# EAGLE design STorM32 Micro BGC v333i micro (EAGLE 7.5.0)
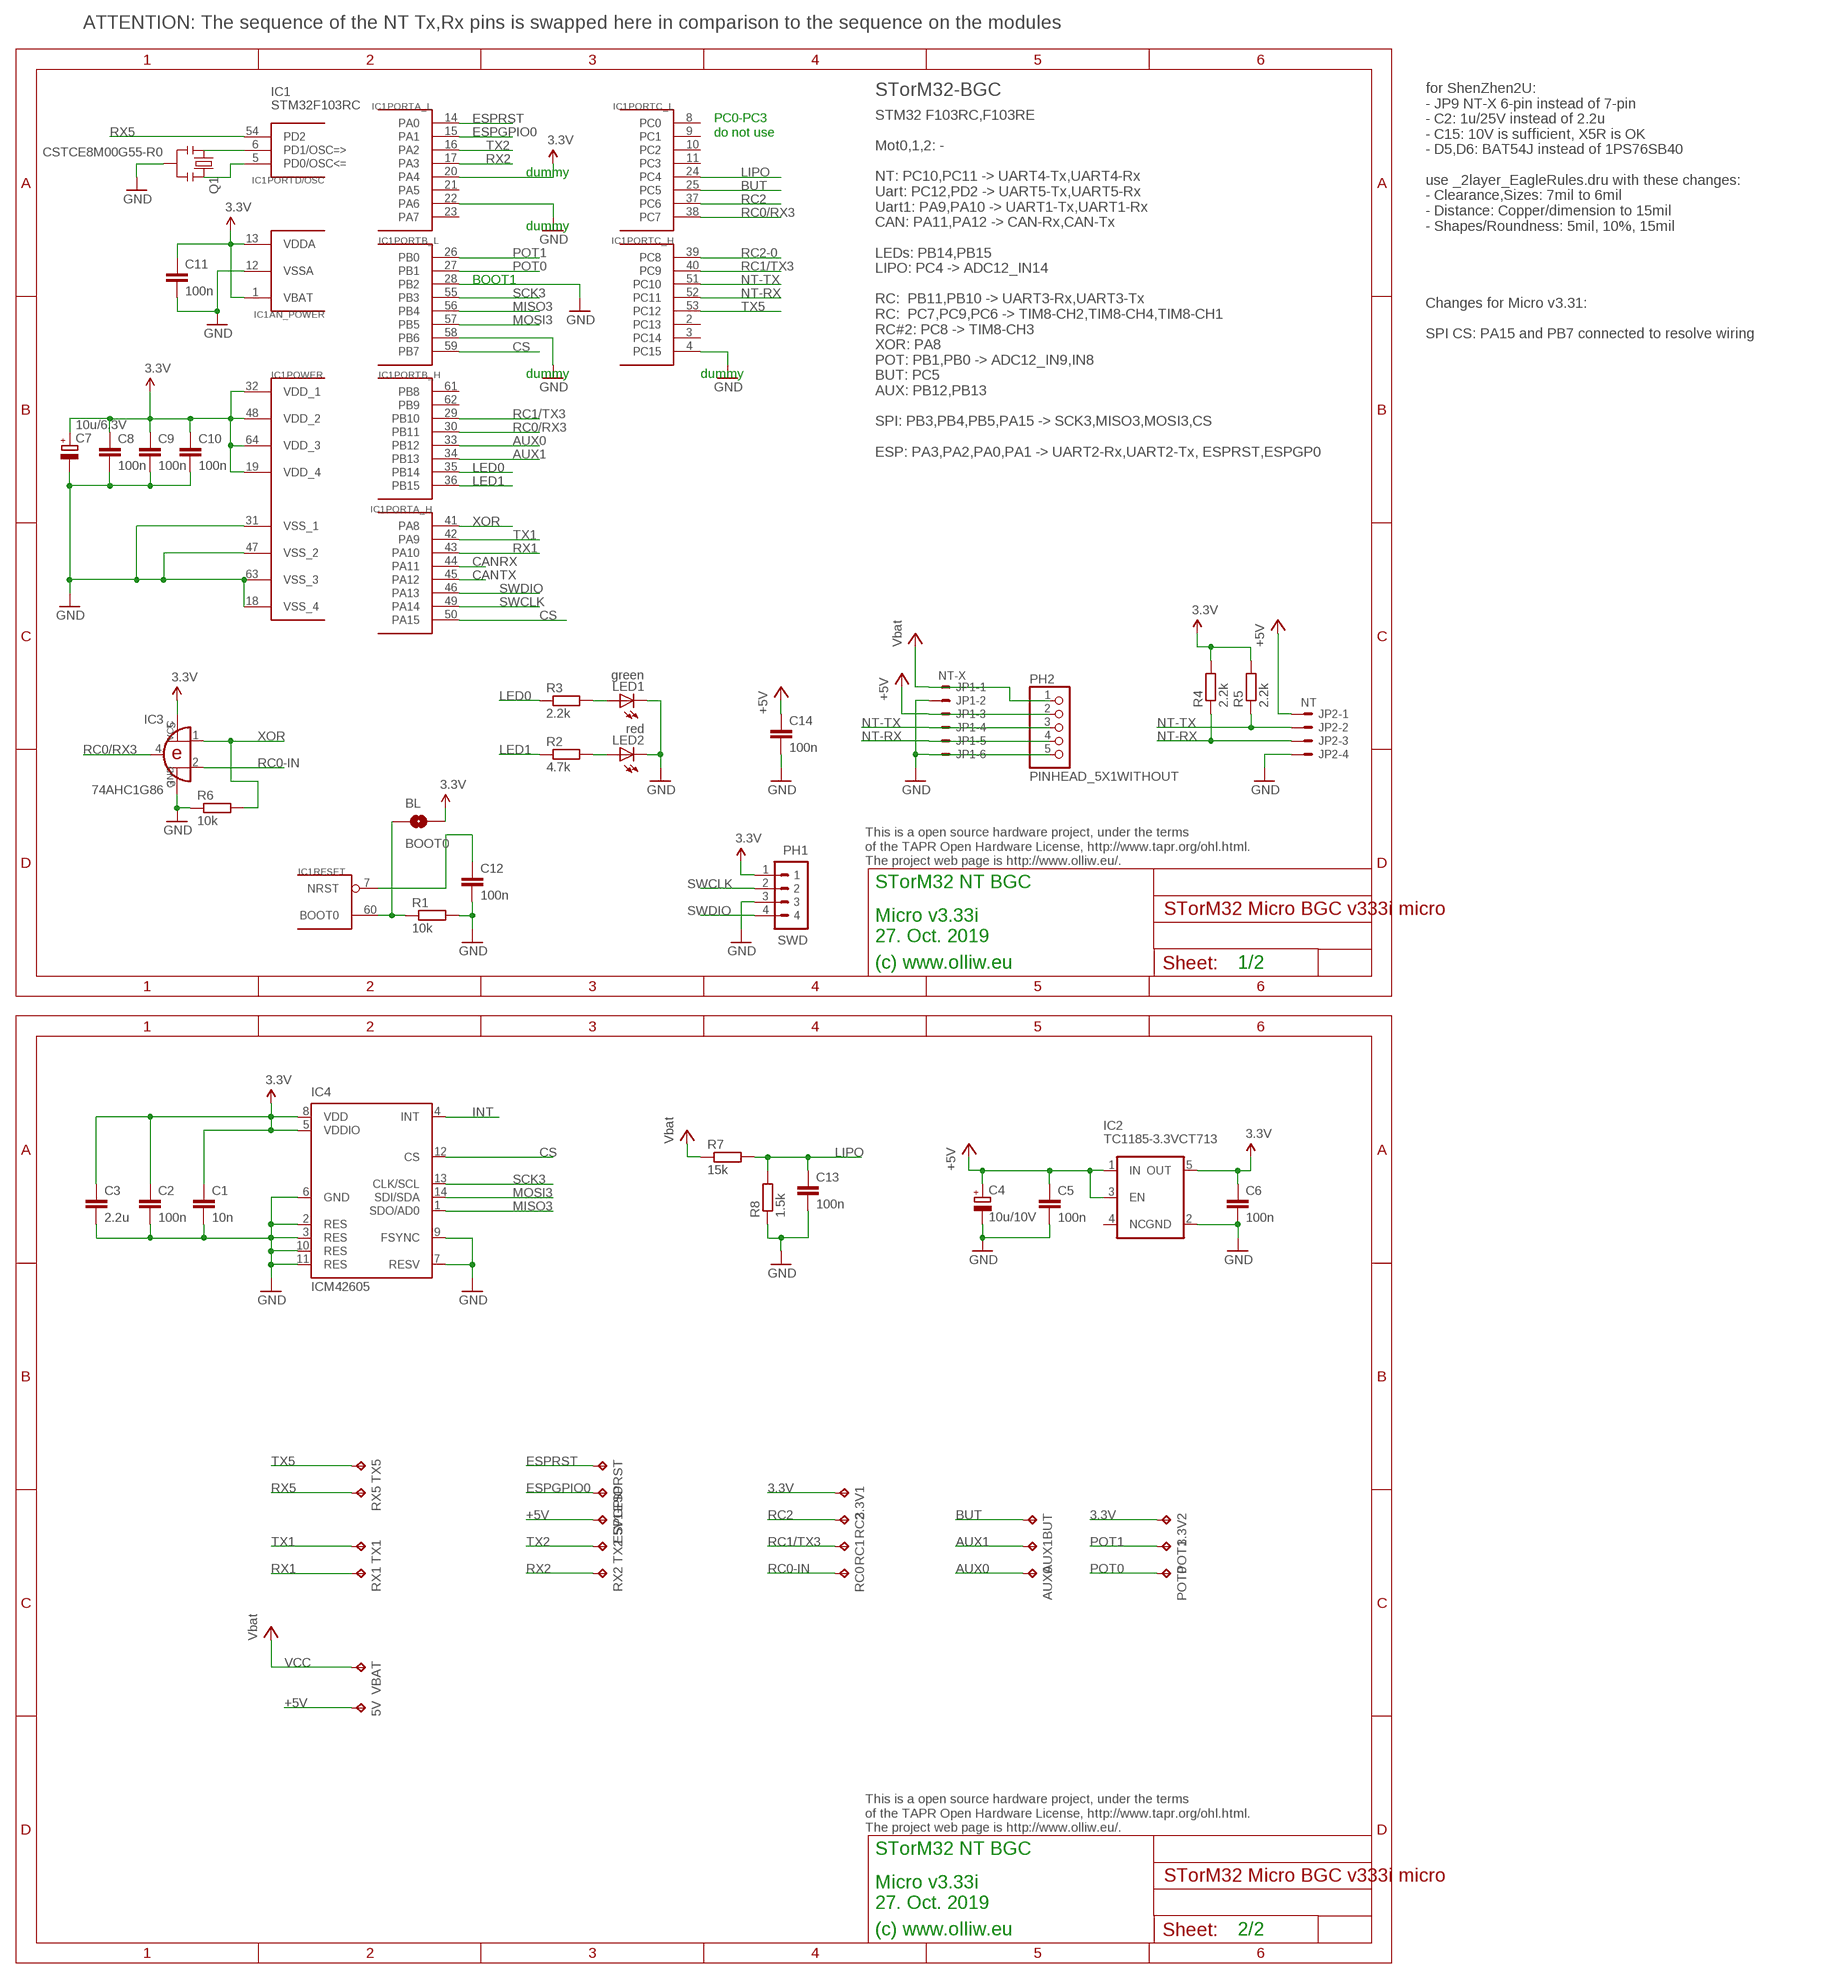
[diagram p0: schematic, sheet 1]

## Parts
3.3V1  TPB1,27  [B1,27]
3.3V2  TPB1,27  [B1,27]
5V  TPB1,27  [B1,27]
5V1  TPB1,27  [B1,27]
AUX0  TPB1,27  [B1,27]
AUX1  TPB1,27  [B1,27]
BL  BOOT0  SOLDERJUMPERNO  [SJ_2S-NO]
BUT  TPB1,27  [B1,27]
C1  10n  C-EUC0402  [C0402]
C2  100n  C-EUC0402  [C0402]
C3  2.2u  C-EUC0603  [C0603]
C4  10u/10V  CPOL-EUSMCA  [SMC_A]
C5  100n  C-EUC0603  [C0603]
C6  100n  C-EUC0402  [C0402]
C7  10u/6.3V  CPOL-EUSMCA  [SMC_A]
C8  100n  C-EUC0402  [C0402]
C9  100n  C-EUC0402  [C0402]
C10  100n  C-EUC0402  [C0402]
C11  100n  C-EUC0402  [C0402]
C12  100n  C-EUC0402  [C0402]
C13  100n  C-EUC0402  [C0402]
C14  100n  C-EUC0402  [C0402]
ESPGPIO  TPB1,27  [B1,27]
ESPRST  TPB1,27  [B1,27]
IC1  STM32F103RCT6  STM32F10XRXT6  [TQFP64]
IC2  TC1185-3.3VCT713  V_REG_TPS76433SOT23-5  [SOT23-5]
IC3  74AHC1G86  [SOT23-5-VER1]
IC4  ICM42605  [LGA14-2.5X3]
JP1  NT-X  SM06B-SRSS-TB  [SM06B-SRSS-TB]
JP2  NT  SM04B-SRSS-TB  [SM04B-SRSS-TB]
LED1  green  LEDCHIPLED_0603  [CHIPLED_0603]
LED2  red  LEDCHIPLED_0603  [CHIPLED_0603]
PH1  SWD  P4X1_1P27-OCT_BILEX  [4X1_1P27_OCT_BILEX]
PH2  PINHEAD_5X1WITHOUT  [PINHEAD_5X1_WO]
POT0  TPB1,27  [B1,27]
POT1  TPB1,27  [B1,27]
Q1  CSTCE8M00G55-R0  RESONATORSMD  [RESONATOR-SMD]
R1  10k  R-EU_R0402  [R0402]
R2  4.7k  R-EU_R0402  [R0402]
R3  2.2k  R-EU_R0402  [R0402]
R4  2.2k  R-EU_R0402  [R0402]
R5  2.2k  R-EU_R0402  [R0402]
R6  10k  R-EU_R0402  [R0402]
R7  15k  R-EU_R0402  [R0402]
R8  1.5k  R-EU_R0402  [R0402]
RC0  TPB1,27  [B1,27]
RC1  TPB1,27  [B1,27]
RC2  TPB1,27  [B1,27]
RX1  TPB1,27  [B1,27]
RX2  TPB1,27  [B1,27]
RX5  TPB1,27  [B1,27]
TX1  TPB1,27  [B1,27]
TX2  TPB1,27  [B1,27]
TX5  TPB1,27  [B1,27]
VBAT  TPB1,27  [B1,27]

## Nets
3.3V: 3.3V1.TP 3.3V2.TP BL.2 C1.1 C2.1 C3.1 C6.1 C7.+ C8.1 C9.1 C10.1 C11.1 IC1.1(AN_POWER:VBAT) IC1.13(AN_POWER:VDDA) IC1.19(POWER:VDD_4) IC1.20(PORTA_L:PA4) IC1.32(POWER:VDD_1) IC1.48(POWER:VDD_2) IC1.64(POWER:VDD_3) IC2.5(OUT) IC3.5(VCC) IC4.5(VDDIO) IC4.8(VDD) PH1.1 R4.2 R5.2
+5V: 5V1.TP 5V.TP C4.+ C5.1 C14.1 IC2.1(IN) IC2.3(EN) JP1.3 JP2.1 PH2.2
AUX0: AUX0.TP IC1.33(PORTB_H:PB12)
AUX1: AUX1.TP IC1.34(PORTB_H:PB13)
BOOT0: BL.1 IC1.60(RESET:BOOT0) R1.1
BUT: BUT.TP IC1.25(PORTC_L:PC5)
CANRX: IC1.44(PORTA_H:PA11)
CANTX: IC1.45(PORTA_H:PA12)
CS: IC1.50(PORTA_H:PA15) IC1.59(PORTB_L:PB7) IC4.12(CS)
ESPGPIO0: ESPGPIO.TP IC1.15(PORTA_L:PA1)
ESPRST: ESPRST.TP IC1.14(PORTA_L:PA0)
GND: C1.2 C2.2 C3.2 C4.- C5.2 C6.2 C7.- C8.2 C9.2 C10.2 C11.2 C12.2 C13.2 C14.2 IC1.4(PORTC_H:PC15) IC1.12(AN_POWER:VSSA) IC1.18(POWER:VSS_4) IC1.22(PORTA_L:PA6) IC1.28(PORTB_L:PB2) IC1.31(POWER:VSS_1) IC1.47(POWER:VSS_2) IC1.58(PORTB_L:PB6) IC1.63(POWER:VSS_3) IC2.2(GND) IC3.3(GND) IC4.2(RES) IC4.3(RES) IC4.6(GND) IC4.7(RESV) IC4.9(FSYNC) IC4.10(RES) IC4.11(RES) JP1.2 JP1.6 JP2.4 LED1.C LED2.C PH1.3 PH2.5 Q1.2 R1.2 R6.1 R8.1
INT: IC4.4(INT)
LED0: IC1.35(PORTB_H:PB14) R3.1
LED1: IC1.36(PORTB_H:PB15) R2.1
LIPO: C13.1 IC1.24(PORTC_L:PC4) R7.2 R8.2
MISO3: IC1.56(PORTB_L:PB4) IC4.1(SDO/AD0)
MOSI3: IC1.57(PORTB_L:PB5) IC4.14(SDI/SDA)
N$8: LED1.A R3.2
N$9: LED2.A R2.2
N$11: IC1.5(PORTD/OSC:PD0/OSC<=) Q1.3
N$12: IC1.6(PORTD/OSC:PD1/OSC=>) Q1.1
NRST: C12.1 IC1.7(RESET:NRST)
NT-RX: IC1.52(PORTC_H:PC11) JP1.5 JP2.3 PH2.4 R4.1
NT-TX: IC1.51(PORTC_H:PC10) JP1.4 JP2.2 PH2.3 R5.1
POT0: IC1.27(PORTB_L:PB1) POT0.TP
POT1: IC1.26(PORTB_L:PB0) POT1.TP
RC0-IN: IC3.2(I1) RC0.TP
RC0/RX3: IC1.30(PORTB_H:PB11) IC1.38(PORTC_L:PC7) IC3.4(O)
RC1/TX3: IC1.29(PORTB_H:PB10) IC1.40(PORTC_H:PC9) RC1.TP
RC2: IC1.37(PORTC_L:PC6) RC2.TP
RC2-0: IC1.39(PORTC_H:PC8)
RX1: IC1.43(PORTA_H:PA10) RX1.TP
RX2: IC1.17(PORTA_L:PA3) RX2.TP
RX5: IC1.54(PORTD/OSC:PD2) RX5.TP
SCK3: IC1.55(PORTB_L:PB3) IC4.13(CLK/SCL)
SWCLK: IC1.49(PORTA_H:PA14) PH1.2
SWDIO: IC1.46(PORTA_H:PA13) PH1.4
TX1: IC1.42(PORTA_H:PA9) TX1.TP
TX2: IC1.16(PORTA_L:PA2) TX2.TP
TX5: IC1.53(PORTC_H:PC12) TX5.TP
VCC: JP1.1 PH2.1 R7.1 VBAT.TP ; supply symbol labelled Vbat
XOR: IC1.41(PORTA_H:PA8) IC3.1(I0) R6.2
Unconnected: IC1.2(PORTC_H:PC13) IC1.3(PORTC_H:PC14) IC1.8(PORTC_L:PC0) IC1.9(PORTC_L:PC1) IC1.10(PORTC_L:PC2) IC1.11(PORTC_L:PC3) IC1.21(PORTA_L:PA5) IC1.23(PORTA_L:PA7) IC1.61(PORTB_H:PB8) IC1.62(PORTB_H:PB9) IC2.4(NC)

## Notes on the sheet
- ATTENTION: The sequence of the NT Tx,Rx pins is swapped here in comparison to the sequence on the modules
- for ShenZhen2U:
  - JP9 NT-X 6-pin instead of 7-pin
  - C2: 1u/25V instead of 2.2u
  - C15: 10V is sufficient, X5R is OK
  - D5,D6: BAT54J instead of 1PS76SB40
  
  use _2layer_EagleRules.dru with these changes:
  - Clearance,Sizes: 7mil to 6mil
  - Distance: Copper/dimension to 15mil
  - Shapes/Roundness: 5mil, 10%, 15mil
- IC1 | STorM32-BGC
- STM32F103RC
- STM32 F103RC,F103RE
  
  Mot0,1,2: -
  
  NT: PC10,PC11 -> UART4-Tx,UART4-Rx
  Uart: PC12,PD2 -> UART5-Tx,UART5-Rx
  Uart1: PA9,PA10 -> UART1-Tx,UART1-Rx
  CAN: PA11,PA12 -> CAN-Rx,CAN-Tx
  
  LEDs: PB14,PB15
  LIPO: PC4 -> ADC12_IN14
  
  RC:  PB11,PB10 -> UART3-Rx,UART3-Tx
  RC:  PC7,PC9,PC6 -> TIM8-CH2,TIM8-CH4,TIM8-CH1
  RC#2: PC8 -> TIM8-CH3
  XOR: PA8
  POT: PB1,PB0 -> ADC12_IN9,IN8
  BUT: PC5
  AUX: PB12,PB13
  
  SPI: PB3,PB4,PB5,PA15 -> SCK3,MISO3,MOSI3,CS
  
  ESP: PA3,PA2,PA0,PA1 -> UART2-Rx,UART2-Tx, ESPRST,ESPGP0
- PC0-PC3
  do not use
- dummy
- dummy
- BOOT1
- Changes for Micro v3.31:
  
  SPI CS: PA15 and PB7 connected to resolve wiring
- dummy | dummy
- This is a open source hardware project, under the terms
  of the TAPR Open Hardware License, http://www.tapr.org/ohl.html.
  The project web page is http://www.olliw.eu/.
- STorM32 NT BGC
- Micro v3.33i
  27. Oct. 2019
- (c) www.olliw.eu | 1/2
- This is a open source hardware project, under the terms
  of the TAPR Open Hardware License, http://www.tapr.org/ohl.html.
  The project web page is http://www.olliw.eu/.
- STorM32 NT BGC
- Micro v3.33i
  27. Oct. 2019
- (c) www.olliw.eu | 2/2

## Library data of the parts
3.3V1 3.3V2 5V 5V1 AUX0 AUX1 BUT ESPGPIO ESPRST POT0 POT1 RC0 RC1 RC2 RX1 RX2 RX5 TX1 TX2 TX5 VBAT = testpad:TP: Test pad
BL = # SparkFun2:SOLDERJUMPER: Solder Jumper Standard SMD solder jumper. Used to automate production. Two varients : Normally Open and Normally Closed are the same, but have different paste layers. NC will have a large amount of paste and should jumper during reflow.
C1-C3 C5 C6 C8-C14 = rcl:C-EU: CAPACITOR, European symbol
C4 C7 = rcl:CPOL-EU: POLARIZED CAPACITOR, European symbol
IC1 = # stm32:STM32F10XRXT6: STM32F101/103 64pin LQFP
IC2 = # SparkFun2:V_REG_TPS76433: Voltage Regulator Older TI part. LDO 150mA regulator. No output by-pass cap option. See V_REG_LDO for a better part.
IC3 = # stdlib:74AHC1G86
IC4 = # stdlib:ICM42605
JP1 = con-jst2:?M06B-SRSS-TB: Disconnectable Crimp style connector, 1.0mm pitch 6 contacts
JP2 = con-jst2:?M04B-SRSS-TB: Disconnectable Crimp style connector, 1.0mm pitch 4 contacts
LED1 LED2 = led:LED: LED OSRAM: - CHIPLED LG R971, LG N971, LY N971, LG Q971, LY Q971, LO R971, LY R971 LH N974, LH R974 LS Q976, LO Q976, LY Q976 LO Q996 - Hyper CHIPLED LW Q18S LB Q993, LB Q99A, LB R99A - SideLED LS A670, LO A670, LY A670, LG A670, LP A670 LB A673, LV A673, LT A673, LW A673 LH A674 LY A675 LS A676, LA A676, LO A676, LY A676, LW A676 LS A679, LY A679, LG A679 - Hyper Micro SIDELED® LS Y876, LA Y876, LO Y876, LY Y876 LT Y87S - SmartLED LW L88C, LW L88S LB L89C, LB L89S, LG L890 LS L89K, LO L89K, LY L89K LS L896, LA L896, LO L896, LY L896 - TOPLED LS T670, LO T670, LY T670, LG T670, LP T670 LSG T670, LSP T670, LSY T670, LOP T670, LYG T670 LG T671, LOG T671, LSG T671 LB T673, LV T673, LT T673, LW T673 LH T674 LS T676, LA T676, LO T676, LY T676, LB T676, LH T676, LSB T676, LW T676 LB T67C, LV T67C, LT T67C, LS T67K, LO T67K, LY T67K, LW E67C LS E67B, LA E67B, LO E67B, LY E67B, LB E67C, LV E67C, LT E67C LW T67C LS T679, LY T679, LG T679 LS T770, LO T770, LY T770, LG T770, LP T770 LB T773, LV T773, LT T773, LW T773 LH T774 LS E675, LA E675, LY E675, LS T675 LS T776, LA T776, LO T776, LY T776, LB T776 LHGB T686 LT T68C, LB T68C - Hyper Mini TOPLED® LB M676 - Mini TOPLED Santana® LG M470 LS M47K, LO M47K, LY M47K Source: http://www.osram.convergy.de LUXEON: - LUMILED® LXK2-PW12-R00, LXK2-PW12-S00, LXK2-PW14-U00, LXK2-PW14-V00 LXK2-PM12-R00, LXK2-PM12-S00, LXK2-PM14-U00 LXK2-PE12-Q00, LXK2-PE12-R00, LXK2-PE12-S00, LXK2-PE14-T00, LXK2-PE14-U00 LXK2-PB12-K00, LXK2-PB12-L00, LXK2-PB12-M00, LXK2-PB14-N00, LXK2-PB14-P00, LXK2-PB14-Q00 LXK2-PR12-L00, LXK2-PR12-M00, LXK2-PR14-Q00, LXK2-PR14-R00 LXK2-PD12-Q00, LXK2-PD12-R00, LXK2-PD12-S00 LXK2-PH12-R00, LXK2-PH12-S00 LXK2-PL12-P00, LXK2-PL12-Q00, LXK2-PL12-R00 Source: www.luxeon.com KINGBRIGHT: KA-3528ASYC Source: www.kingbright.com
PH1 = # stdlib:P4X1_1P27
PH2 = # stdlib:PINHEAD_5X1
Q1 = # SparkFun2:RESONATOR: Resonator Small SMD resonator. This is the itty bitty 10/20MHz resonators with built in caps. CSTCE10M0G55 and CSTCE20M0V53. Footprint has been reviewed closely but hasn't been tested yet.
R1-R8 = rcl:R-EU_: RESISTOR, European symbol

## Board
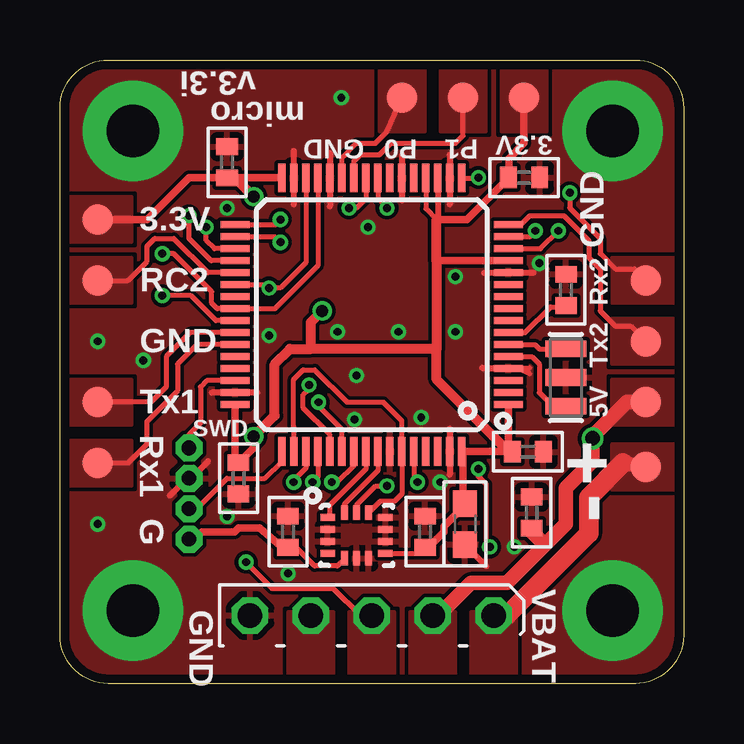
[diagram p1: board, top side]
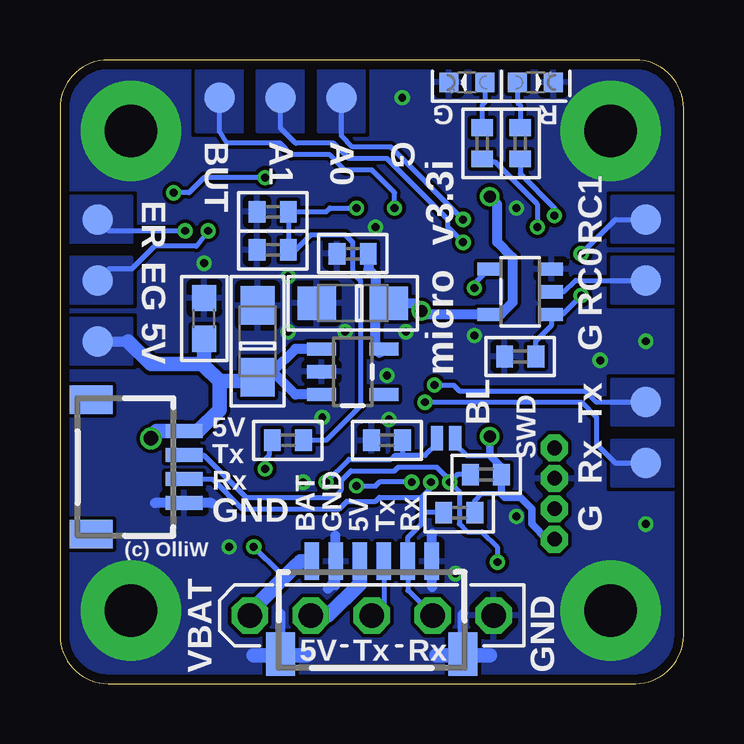
[diagram p2: board, bottom side, seen from below]

Size 26 x 26 mm. Coordinates in mm from the lower left corner, seen from the top.
Outline: 24,0 2,0 arc-90 0,2 0,24 arc-90 2,26 24,26 arc-90 26,24 26,2 arc-90 24,0
Copper layers (1*16): Top 0.035mm / dielectric 1.5mm / Bottom 0.035mm
Design rules "ShenZhen2U_2layer_EagleRules *": minimum track width 6mil, minimum drill 12mil, track to track 6mil, track to pad 6mil, pad to pad 6mil, via to via 6mil, smd to smd 0mil, copper to edge 15mil, drill to drill 10mil, minimum pad ring 10mil, minimum via ring 6mil, stop-mask expansion 2mil, vias tented up to drill 25mil, thermal gap 10mil

### Footprints (pad centres in the part's own frame; a part is rotated, then mirrored left to right if it is on the bottom)
B1,27 = smd 1.27 x 1.27: TP 0,0
SJ_2S-NO = smd 0.508 x 1.016: 1 -0.381,0; 2 0.381,0
C0402 = smd 0.7 x 0.9: 1 -0.65,0; 2 0.65,0
C0603 = smd 1.1 x 1: 1 -0.85,0; 2 0.85,0
SMC_A = smd 1.6 x 1.4: + -1.5,0; - 1.5,0
TQFP64 = smd 1.2 x 0.3: 1 -5.7,3.75; 2 -5.7,3.25; 3 -5.7,2.75; 4 -5.7,2.25; 5 -5.7,1.75; 6 -5.7,1.25; 7 -5.7,0.75; 8 -5.7,0.25; 9 -5.7,-0.25; 10 -5.7,-0.75; 11 -5.7,-1.25; 12 -5.7,-1.75; 13 -5.7,-2.25; 14 -5.7,-2.75; 15 -5.7,-3.25; 16 -5.7,-3.75; 33 5.7,-3.75; 34 5.7,-3.25; 35 5.7,-2.75; 36 5.7,-2.25; 37 5.7,-1.75; 38 5.7,-1.25; 39 5.7,-0.75; 40 5.7,-0.25; 41 5.7,0.25; 42 5.7,0.75; 43 5.7,1.25; 44 5.7,1.75; 45 5.7,2.25; 46 5.7,2.75; 47 5.7,3.25; 48 5.7,3.75 | smd 0.3 x 1.2: 17 -3.75,-5.7; 18 -3.25,-5.7; 19 -2.75,-5.7; 20 -2.25,-5.7; 21 -1.75,-5.7; 22 -1.25,-5.7; 23 -0.75,-5.7; 24 -0.25,-5.7; 25 0.25,-5.7; 26 0.75,-5.7; 27 1.25,-5.7; 28 1.75,-5.7; 29 2.25,-5.7; 30 2.75,-5.7; 31 3.25,-5.7; 32 3.75,-5.7; 49 3.75,5.7; 50 3.25,5.7; 51 2.75,5.7; 52 2.25,5.7; 53 1.75,5.7; 54 1.25,5.7; 55 0.75,5.7; 56 0.25,5.7; 57 -0.25,5.7; 58 -0.75,5.7; 59 -1.25,5.7; 60 -1.75,5.7; 61 -2.25,5.7; 62 -2.75,5.7; 63 -3.25,5.7; 64 -3.75,5.7
SOT23-5 = smd 0.55 x 1.2: 1 -0.95,-1.3; 2 0,-1.3; 3 0.95,-1.3; 4 0.95,1.3; 5 -0.95,1.3
SOT23-5-VER1 = smd 0.55 x 0.99: 1 -0.95,-1.29; 2 0,-1.29; 3 0.95,-1.29; 4 0.95,1.3; 5 -0.95,1.3
LGA14-2.5X3 = smd 0.6 x 0.3: 1 -1.2,0.75; 2 -1.2,0.25; 3 -1.2,-0.25; 4 -1.2,-0.75; 8 1.2,-0.75; 9 1.2,-0.25; 10 1.2,0.25; 11 1.2,0.75 | smd 0.3 x 0.6: 5 -0.5,-0.95; 6 0,-0.95; 7 0.5,-0.95; 12 0.5,0.95; 13 0,0.95; 14 -0.5,0.95
SM06B-SRSS-TB = smd 0.6 x 1.55: 1 -2.5,2.975; 2 -1.5,2.975; 3 -0.5,2.975; 4 0.5,2.975; 5 1.5,2.975; 6 2.5,2.975 | smd 1.2 x 1.8: FIT@1 -3.8,-0.9; FIT@2 3.8,-0.9
SM04B-SRSS-TB = smd 0.6 x 1.55: 1 -1.5,2.975; 2 -0.5,2.975; 3 0.5,2.975; 4 1.5,2.975 | smd 1.2 x 1.8: FIT@1 -2.8,-0.9; FIT@2 2.8,-0.9
CHIPLED_0603 = smd 0.8 x 0.8: A 0,-0.75; C 0,0.75
4X1_1P27_OCT_BILEX = drill 0.61 pad 1.118 octagon: 1 0,0; 2 0,-1.27; 3 0,-2.54; 4 0,-3.81
PINHEAD_5X1_WO = drill 1.016 octagon: 1 0,0; 2 0,-2.54; 3 0,-5.08; 4 0,-7.62; 5 0,-10.16
RESONATOR-SMD = smd 0.7 x 1.7: 1 -1.2,0; 2 0,0; 3 1.2,0
R0402 = smd 0.7 x 0.9: 1 -0.65,0; 2 0.65,0

### Placement (x,y rotation side)
3.3V1  1.57,19.35 0 top
3.3V2  19.35,24.43 0 top
5V  24.43,11.73 0 top
5V1  24.43,14.27 0 bottom
AUX0  14.27,24.43 0 bottom
AUX1  16.81,24.43 0 bottom
BL  9.9,10.22 0 bottom
BUT  19.35,24.43 0 bottom
C1  15.22,6.33 90 top
C2  9.51,6.33 90 top
C3  16.89,6.65 270 top
C4  17.76,14.27 90 bottom
C5  19.98,15.22 90 bottom
C6  13.79,17.92 180 bottom
C7  13.79,15.86 180 bottom
C8  19.51,9.67 0 top
C9  6.97,21.73 90 top
C10  7.44,8.55 270 top
C11  19.35,21.1 0 top
C12  21.1,16.41 90 top
C13  17.13,19.67 180 bottom
C14  19.67,7.13 90 top
ESPGPIO  24.43,16.81 0 bottom
ESPRST  24.43,19.35 0 bottom
IC1  13,15.38 180 top
IC2  13.79,13 270 bottom
IC3  6.81,16.33 90 bottom
IC4  12.37,6.17 0 top
JP1  13,2.13 0 bottom
JP2  23.8,9.03 270 bottom
LED1  9.03,25.06 90 bottom
LED2  6.17,25.06 270 bottom
PH1  5.38,6.02 180 top
PH2  18.08,2.84 270 top
POT0  14.27,24.43 0 top
POT1  16.81,24.43 0 top
Q1  21.1,12.76 270 top
R1  12.37,10.14 180 bottom
R2  6.81,22.52 90 bottom
R3  8.4,22.52 90 bottom
R4  9.35,7.13 0 bottom
R5  8.24,8.71 0 bottom
R6  6.81,13.63 0 bottom
R7  16.49,10.14 0 bottom
R8  17.13,18.08 0 bottom
RC0  1.57,16.81 0 bottom
RC1  1.57,19.35 0 bottom
RC2  1.57,16.81 0 top
RX1  1.57,9.19 0 top
RX2  24.43,16.81 0 top
RX5  1.57,9.19 0 bottom
TX1  1.57,11.73 0 top
TX2  24.43,14.27 0 top
TX5  1.57,11.73 0 bottom
VBAT  24.43,9.03 0 top

### Tracks (layer width: path | path; a pad name or v marks a point on that pad's centre or on a via)
3.3V  (via drill 0.5)
  Top 0.203: 18.72,21.11 C11.1 | IC1.20 15.25,19.8 15.7,19.35 15.75,19.4 | IC4.5 11.71,5.04 11.57,4.9 10.62,4.9 9.83,5.7 9.57,5.52 C2.1 | C2.1 9.51,5.54 | 15.45,5.76 C1.1 15.12,5.42 IC4.8 | C2.1 9.36,5.6
  Top 0.254: IC1.19 15.75,19.4
  Top 0.305: C11.1 18.72,21.1 | 18.72,21.1 16.97,19.35 15.7,19.35 | C8.1 18.69,9.68 IC1.64 16.81,9.62 16.81,7.92 16.89,7.84 C3.1 16.89,7.42 16.02,6.55 16.02,6.33 15.45,5.76 | 18.7,9.68 IC1.1 | IC1.48 7.3,9.51 C10.1 8.08,9.82 v8.08,10.3 | 3.3V2.TP 19.35,22.52 18.72,21.89 18.72,21.11 18.72,21.1 | 3.3V1.TP 3.63,19.35 5.38,21.1 6.97,21.1 | 7.14,21.1 C9.1 7.11,21.24 6.97,21.1 | IC1.32 9.25,21.2 9.19,21.1 7.14,21.1 | 7.14,21.1 6.97,21.1 | IC1.13 15.73,17.63 15.7,17.6 | PH1.1 5.62,6.02 5.94,6.33 7.29,6.33 7.44,6.49 8.32,6.49 9.36,5.6
  Top 0.406: 15.7,19.35 15.7,17.6 15.7,13.95 | C8.1 18.7,9.68 15.7,12.68 15.7,13.95 | v8.08,10.3 8.95,11.17 8.95,13.32 9.59,13.95 10.46,13.95 | 15.7,13.95 10.46,13.95 | 10.46,13.95 10.46,15.06 v10.94,15.54 | v8.08,20.3 7.3,21.08 C9.1
  Bottom 0.203: R4.2 8.7,7.62 8.4,7.92 7.6,7.92 7.59,7.9 | BL.2 9.52,10 9.03,9.51 8.08,9.51
  Bottom 0.305: PH1.1 5.7,6.02 6.33,6.65 6.33,7.29 6.81,7.76 7.44,7.76 7.59,7.9 R5.2 7.6,8.73 7.6,9.03 8.08,9.51 v8.08,10.3
  Bottom 0.406: C7.+ 11.25,15.86 v10.94,15.54 10.78,15.38 10.77,15.38 IC3.5 7.64,15.38 7.13,15.89 7.13,17.76 7.76,18.4 7.76,19.98 v8.08,20.3 | IC2.5 12.68,13.79 12.84,13.95 12.84,15.77 | 12.84,15.47 C7.+ | C6.1 13.14,17.27 12.84,16.97 12.84,15.77 | 12.84,15.77 C7.+
  pour Top (isolate 0.305, no thermals): 0.14,20.3 3,20.3 3,18.4 0.14,18.4
  pour Top (isolate 0.305, no thermals): 18.4,25.86 20.3,25.86 20.3,23 18.4,23
+5V  (via drill 0.6)
  Top 0.203: C14.1 19.67,6.33
  Top 0.61: 5V.TP 23.64,11.73 22.21,10.3 v22.21,10.22 22.21,9.27 21.1,8.16 21.1,6.65 20.22,5.78 | PH2.2 15.78,2.84 17.13,4.19 18.64,4.19 20.22,5.78 | 19.67,6.33 20.22,5.78
  Bottom 0.305: 17.29,13.16 17.83,12.37 C4.+ 17.85,12.52 17.13,13
  Bottom 0.406: IC2.3 16.18,12.05 17.29,13.16 | IC2.1 16.18,13.95 17.13,13 | 5V1.TP 23.16,14.27 | 20.09,13.32 C5.1
  Bottom 0.61: JP1.3 13.5,4.17 14.83,2.84 PH2.2 | v22.21,10.22 22.21,10.3 21.98,10.53 JP2.1 20.23,10.53 19.35,11.41 19.35,12.61 | C5.1 19.98,13.25 19.35,12.61 | 23.16,14.27 22.21,13.32 20.09,13.32 | 19.35,12.61 17.92,12.61 C4.+
  pour Top (isolate 0.305, no thermals): 23,12.68 25.86,12.68 25.86,10.78 23,10.78
  pour Bottom (isolate 0.305, no thermals): 23,15.22 25.86,15.22 25.86,13.32 23,13.32
  pour Top (isolate 0.305, no thermals): 14.59,0.14 14.59,3 16.49,3 16.49,0.14
AUX0  (via drill 0.33)
  Top 0.203: IC1.33 8.97,19.13 v9.19,19.35
  Bottom 0.203: v9.19,19.35 12.21,22.37 13.79,22.37 14.27,22.84 AUX0.TP
  pour Bottom (isolate 0.305, no thermals): 13.32,25.86 15.22,25.86 15.22,23 13.32,23
AUX1  (via drill 0.33)
  Top 0.203: IC1.34 8.96,18.63 v9.19,18.4
  Bottom 0.203: v9.19,18.4 9.83,19.03 9.83,19.35 12.37,21.89 13.95,21.89 14.59,22.52 16.18,22.52 16.81,23.16 AUX1.TP
  pour Bottom (isolate 0.305, no thermals): 15.86,25.86 17.76,25.86 17.76,23 15.86,23
BOOT0  (via drill 0.33)
  Top 0.203: IC1.60 14.75,8.56 v14.91,8.4
  Bottom 0.203: v14.91,8.4 13.95,9.35 12.21,9.35 12.05,9.51 11.73,9.51 | 11.73,10.13 R1.1 11.72,9.52 11.73,9.51 | BL.1 10.29,10 10.78,9.51 11.73,9.51
BUT  (via drill 0.33)
  Top 0.203: IC1.25 12.75,20.21 12.37,19.83 v12.05,19.83
  Bottom 0.203: v12.05,19.83 12.05,20.46 13,21.41 14.11,21.41 14.75,22.05 16.33,22.05 16.81,22.52 19.03,22.52 19.35,23 BUT.TP
  pour Bottom (isolate 0.305, no thermals): 18.4,25.86 20.3,25.86 20.3,23 18.4,23
CS
  Top 0.203: IC4.12 13.34,7.6 13.95,7.6 14.25,7.9 IC1.59 14.25,10.96 13.48,11.73 11.97,11.73 10.62,13.08 10.14,13.08 9.75,12.68 9.75,10.7 9.75,10.69 IC1.50
ESPGPIO0  (via drill 0.33)
  Top 0.203: IC1.15 19.59,18.63 v19.83,18.87
  Bottom 0.203: v19.83,18.87 20.3,18.24 22.05,18.24 23,17.29 23.95,17.29 ESPGPIO.TP
  pour Bottom (isolate 0.305, no thermals): 25.86,17.76 23,17.76 23,15.86 25.86,15.86
ESPRST  (via drill 0.33)
  Top 0.203: IC1.14 20.04,18.13 v20.78,18.87
  Bottom 0.203: v20.78,18.87 23.95,18.87 ESPRST.TP
  pour Bottom (isolate 0.305, no thermals): 25.86,20.3 23,20.3 23,18.4 25.86,18.4
GND  (via drill 0.33, 2.2 pad 4.2)
  Top 0.203: 19.59,13.16 19.11,13.16 19.59,12.92
  Top 0.254: 9.75,22.21 9.75,19.98 | 11.25,22.13 11.25,19.91 | 14.27,22.05 14.27,20.14 | 16.25,22.05 16.25,19.98 | 17.68,17.13 19.75,17.13 | 17.6,13.16 19.11,13.16 | 8.24,12.13 6.33,12.13 | 16.25,10.62 16.25,8.71 | 17.05,5.62 17.76,4.9 | 4.59,7.84 5.38,8.63 | 5.38,8.48 6.17,9.27
  Bottom 0.406: 19.67,7.52 22.05,7.52 | 10.49,4.03 10.49,6.25 | 16.81,0.7 16.81,2.92 | 14.51,4.11 14.51,4.29 | 14.51,4.29 14.51,6.17 | 14.84,3.96 14.51,4.29 | 9.19,0.7 9.19,2.92
  Bottom 0.61: 17.92,1.17 15.7,1.17 | 10.3,1.17 8.08,1.17
  other vias: 3.04,3.04 23.04,3.04 3.04,23.04 23.04,23.04 15.06,11.1 11.73,24.43 1.57,14.27 1.57,6.65 15.86,8.4 3.48,13.48 12.37,12.84 16.49,14.67 16.49,16.97 12.84,19.03 18.95,5.7 19.98,17.52 6.97,19.83 9.51,4.59 14.11,14.67 11.57,14.67 8.71,14.51 12.29,11.02 6.97,6.97
  pour Top (isolate 0.152, rank 6): -0.97,-0.97 -0.97,26.97 26.97,26.97 26.97,-0.97
  pour Bottom (isolate 0.152, rank 6): -0.34,-0.34 -0.34,26.34 26.34,26.34 26.34,-0.34
LED0  (via drill 0.33)
  Top 0.203: IC1.35 6.44,18.13 6.09,18.48 v6.09,19.03
  Bottom 0.203: v6.09,19.03 6.09,19.98 7.84,21.73 8.08,21.73 8.24,21.89 R3.1
LED1  (via drill 0.33)
  Top 0.203: IC1.36 6.3,17.63 5.38,18.56 v5.38,19.51
  Bottom 0.203: R2.1 6.81,21.26 5.38,19.83 v5.38,19.51
LIPO  (via drill 0.33)
  Top 0.203: v13.64,19.83 13.25,20.21 IC1.24
  Bottom 0.203: v13.64,19.83 14.75,19.83 14.91,19.67 16.18,19.67 16.33,19.68 C13.1 R8.2 16.18,18.08 15.54,18.71 14.11,18.71 13.79,18.4 13.79,17.13 13.48,16.81 13.48,11.57 14.91,10.14 R7.2
MISO3
  Top 0.203: IC1.56 12.75,8.94 11.25,7.44 11.25,6.97 11.21,6.92 IC4.1
MOSI3
  Top 0.203: IC1.57 13.25,8.88 11.87,7.5 IC4.14
N$8
  Bottom 0.203: LED1.A 8.28,24.23 8.4,24.11 R3.2
N$9
  Bottom 0.203: LED2.A 6.92,24.23 6.81,24.11 R2.2
N$11
  Top 0.203: IC1.5 19.67,13.63 19.98,13.32 19.98,12.13 20.46,11.65 21.33,11.65 Q1.3
N$12
  Top 0.203: IC1.6 19.81,14.13 19.98,13.95 21.01,13.95 Q1.1
NRST
  Top 0.203: IC1.7 19.39,14.63 20.46,15.7 21.11,15.7 C12.1
NT-RX  (via drill 0.33)
  Top 0.203: IC1.52 10.75,8.61 v10.54,8.4
  Bottom 0.203: PH2.4 11.5,3.88 JP1.5 11.5,6.09 10.94,6.65 10.94,7.13 | JP2.3 19.64,8.53 18.4,7.29 14.35,7.29 14.03,7.6 12.84,7.6 12.68,7.76 10.94,7.76 | 10.94,7.76 10.54,8.16 v10.54,8.4 | 10.94,7.76 10.94,7.13 | R4.1 10.94,7.13
  pour Top (isolate 0.305, no thermals): 9.51,0.14 9.51,3 11.41,3 11.41,0.14
NT-TX  (via drill 0.33)
  Top 0.203: IC1.51 10.25,8.98 9.75,8.48 v9.75,8.4 | PH2.3 12.52,2.84 11.41,3.95 8.87,3.95 v7.76,5.06
  Bottom 0.203: JP1.4 12.5,3.34 PH2.3 | JP2.2 20.01,9.53 18.24,7.76 14.59,7.76 14.27,8.08 14.27,8.48 13.87,8.87 12.05,8.87 11.89,9.03 10.3,9.03 9.75,8.48 v9.75,8.4 | v9.75,8.4 9.35,8 9.35,6.65 9.03,6.33 8.4,6.33 7.76,5.7 v7.76,5.06 | R5.1 9.43,8.71 v9.75,8.4
  pour Top (isolate 0.305, no thermals): 12.05,0.14 12.05,3 13.95,3 13.95,0.14
POT0
  Top 0.203: IC1.27 11.75,21.91 12.37,22.52 13.16,22.52 13.64,23 POT0.TP
  pour Top (isolate 0.305, no thermals): 13.32,25.86 13.32,23 15.22,23 15.22,25.86
POT1
  Top 0.203: IC1.26 12.25,21.77 12.52,22.05 13.32,22.05 13.79,22.52 16.49,22.52 16.81,22.84 POT1.TP
  pour Top (isolate 0.305, no thermals): 15.86,25.86 17.76,25.86 17.76,23 15.86,23
RC0-IN
  Bottom 0.203: IC3.2 4.98,16.33 4.51,16.81 RC0.TP
  pour Bottom (isolate 0.305, no thermals): 0.14,17.76 3,17.76 3,15.86 0.14,15.86
RC0/RX3  (via drill 0.33)
  Top 0.203: IC1.30 10.25,17.55 9.19,16.49 v8.71,16.49 8.54,16.63 IC1.38
  Bottom 0.203: IC3.4 8.71,16.68 v8.71,16.49
RC1/TX3  (via drill 0.33)
  Top 0.203: IC1.29 10.75,17.42 8.96,15.63 IC1.40 6.56,15.63 6.33,15.86 6.33,16.33 4.75,17.92 v4.27,17.92
  Bottom 0.203: v4.27,17.92 2.84,19.35 RC1.TP
  pour Bottom (isolate 0.305, no thermals): 0.14,20.3 3,20.3 3,18.4 0.14,18.4
RC2
  Top 0.203: IC1.37 6.17,17.13 4.75,18.56 3.95,18.56 3.63,18.24 3.63,17.6 2.84,16.81 RC2.TP
  pour Top (isolate 0.305, no thermals): 0.14,17.76 3,17.76 3,15.86 0.14,15.86
RX1
  Top 0.203: RX1.TP 2.84,9.19 3.63,9.98 3.63,10.94 4.9,12.21 4.9,13.32 5.72,14.13 IC1.43
  pour Top (isolate 0.305, no thermals): 0.14,10.14 3,10.14 3,8.24 0.14,8.24
RX2  (via drill 0.33)
  Top 0.203: IC1.17 17.3,21.08 v17.45,21.1 | v21.26,20.46 21.26,19.83 22.52,18.56 22.52,17.92 23.16,17.29 23.95,17.29 RX2.TP
  Bottom 0.203: v17.45,21.1 19.98,21.1 20.62,20.46 v21.26,20.46
  pour Top (isolate 0.305, no thermals): 23,17.76 25.86,17.76 25.86,15.86 23,15.86
RX5  (via drill 0.33)
  Top 0.203: IC1.54 11.75,10.6 10.78,11.57 v10.78,11.73
  Bottom 0.203: v10.78,11.73 4.27,11.73 3.63,11.1 3.63,9.98 2.84,9.19 RX5.TP
  pour Bottom (isolate 0.305, no thermals): 0.14,10.14 3,10.14 3,8.24 0.14,8.24
SCK3  (via drill 0.33)
  Top 0.203: IC1.55 12.25,9.07 11.57,8.4 v11.33,8.4 | IC4.13 12.37,7.44 13.16,8.24 v13.64,8.24
  Bottom 0.203: v13.64,8.24 12.84,8.24 12.68,8.4 v11.33,8.4
SWCLK
  Top 0.203: IC1.49 9.25,9.25 8.55,8.55 6.97,8.55 5.7,7.29 PH1.2
SWDIO
  Top 0.203: IC1.46 6.12,12.63 5.86,12.37 5.86,10.86 5.38,10.38 PH1.4
TX1
  Top 0.203: TX1.TP 3.79,11.73 4.43,12.37 4.43,13.63 5.42,14.63 IC1.42
  pour Top (isolate 0.305, no thermals): 3,12.68 0.14,12.68 0.06,10.78 3,10.78
TX2
  Top 0.203: IC1.16 19.21,19.13 19.59,19.51 21.02,19.51 22.05,18.48 22.05,17.76 22.52,17.29 22.52,15.54 23.16,14.9 23.8,14.9 TX2.TP
  pour Top (isolate 0.305, no thermals): 23,13.32 25.86,13.32 25.86,15.22 23,15.22
TX5  (via drill 0.33)
  Top 0.203: IC1.53 11.25,10.38 10.14,11.49 10.14,12.05 10.38,12.29 v10.38,12.44
  Bottom 0.203: v10.38,12.44 9.59,12.44 9.35,12.21 4.11,12.21 3.63,11.73 TX5.TP
  pour Bottom (isolate 0.305, no thermals): 0.14,12.68 3,12.68 3,10.78 0.14,10.78
VCC  (via drill 0.33)
  Top 0.203: v17.45,8.95 17.45,8.63 17.76,8.32 17.76,5.86 v17.92,5.7
  Top 0.61: VBAT.TP 23.48,9.19
  Top 0.813: 23.48,9.19 22.05,7.76 22.05,6.25 18.64,2.84 PH2.1
  Bottom 0.203: R7.1 17.29,10.3 17.29,9.51 17.45,9.35 v17.45,8.95 | 16.18,4.9 16.18,5.06 16.81,4.43 16.81,4.59 v17.92,5.7
  Bottom 0.61: JP1.1 15.98,5.1 16.18,4.9 18.08,3 PH2.1
  pour Top (isolate 0.305, no thermals): 23,9.98 25.86,9.98 25.86,8.08 23,8.08
  pour Top (isolate 0.305, no thermals): 17.13,0.14 17.13,3 19.03,3 19.03,0.14
XOR  (via drill 0.33)
  Top 0.203: IC1.41 6.5,15.13 5.46,16.17 v4.27,16.17
  Bottom 0.203: v4.27,16.17 5.06,15.38 5.68,15.38 IC3.1 5.52,14.92 6.16,14.28 R6.2

### Text on the board
tNames: v3.3i | micro | GND | P0 | P1 | 3.3V | 3.3V | GND | RC2 | Rx2 | GND | Tx2 | Rx1 | Tx1 | SWD | 5V | + | - | G | VBAT | GND
bNames: R | G | G | A0 | A1 | BUT | v3.3i | ER | RC1 | EG | RC0 | micro | 5V | G | SWD | Tx | BL | 5V | Rx | Tx | Rx | G | Rx | Tx | 5V | GND | BAT | GND | (c) OlliW | GND | Rx | Tx | 5V | VBAT